# Altium schematic sheet connectors.SchDoc
size A
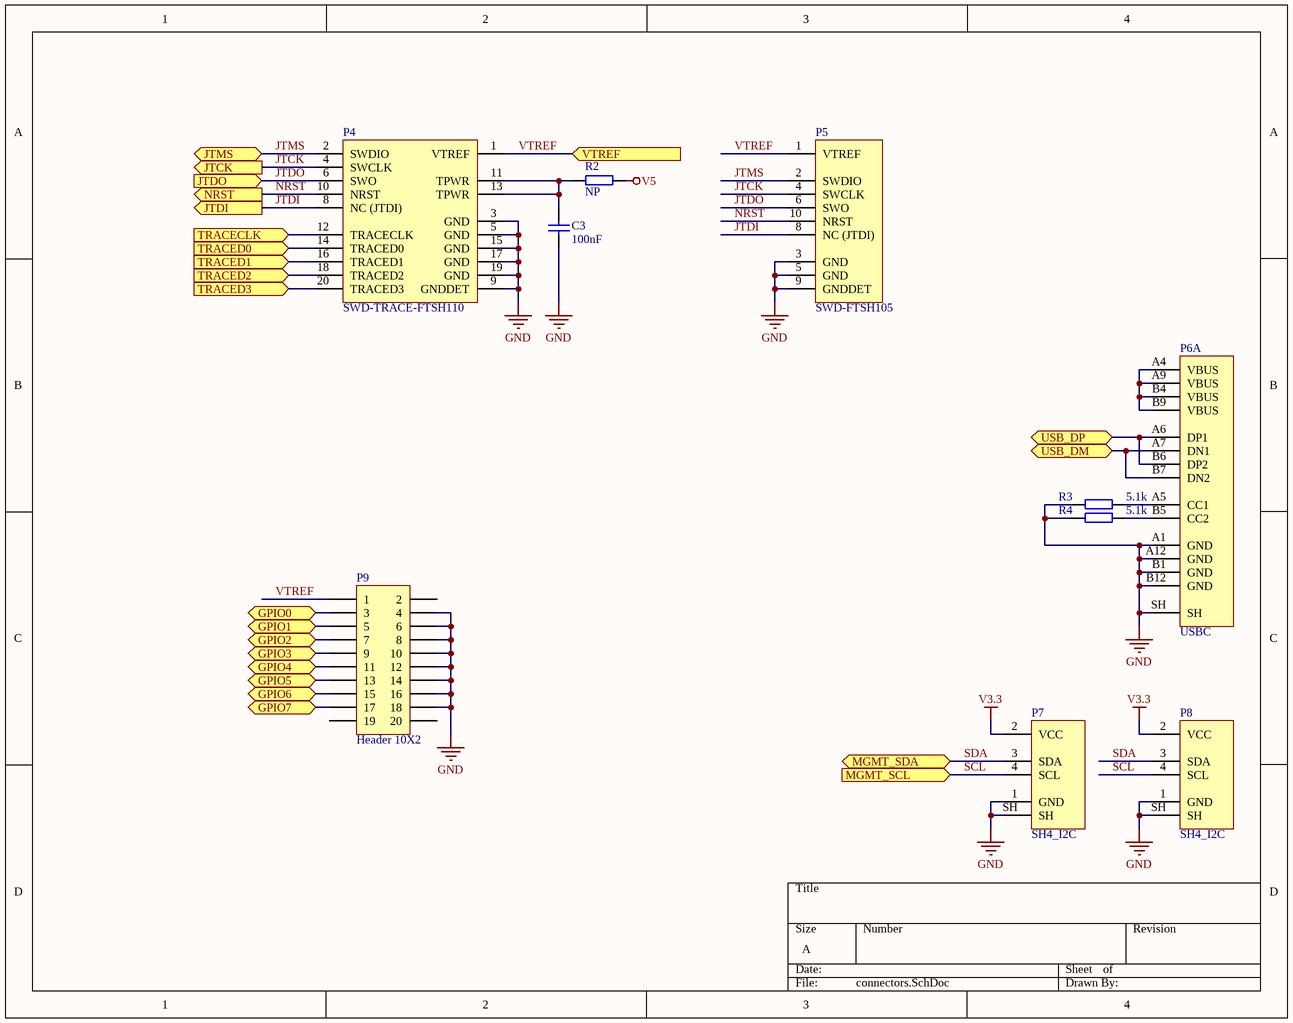
[diagram p0: connectors.SchDoc]

## Parts
C3  100nF  [0402]
P4  SWD-TRACE-FTSH110  [FTSH110]
P5  SWD-FTSH105  [FTSH105]
P6  USBC  [U262-161N-4BVC11]  (part A of 2)
P7  SH4_I2C  [SM04B]
P8  SH4_I2C  [SM04B]
P9  Header 10X2  [HDR2X10]
R2  NP  [0402]
R3  5.1k  [0402]
R4  5.1k  [0402]

## Ports
GPIO0 (bidir), GPIO1 (bidir), GPIO2 (bidir), GPIO3 (bidir), GPIO4 (bidir), GPIO5 (bidir), GPIO6 (bidir), GPIO7 (bidir), JTCK (out), JTDI (out), JTDO (in), JTMS (bidir), MGMT_SCL (in), MGMT_SDA (bidir), NRST (out), TRACECLK (in), TRACED0 (in), TRACED1 (in), TRACED2 (in), TRACED3 (in), USB_DM, USB_DP, VTREF (in)

## Nets
GND: C3.1 P4.3(GND) P4.5(GND) P4.9(GNDDET) P4.15(GND) P4.17(GND) P4.19(GND) P5.3(GND) P5.5(GND) P5.9(GNDDET) P6.A1(GND) P6.A12(GND) P6.B1(GND) P6.B12(GND) P6.SH P7.1(GND) P7.SH P8.1(GND) P8.SH P9.4 P9.6 P9.8 P9.10 P9.12 P9.14 P9.16 P9.18 R3.1 R4.1
V3.3: P7.2(VCC) P8.2(VCC)
V5: R2.2
GPIO0: P9.3 ; port GPIO0
GPIO1: P9.5 ; port GPIO1
GPIO2: P9.7 ; port GPIO2
GPIO3: P9.9 ; port GPIO3
GPIO4: P9.11 ; port GPIO4
GPIO5: P9.13 ; port GPIO5
GPIO6: P9.15 ; port GPIO6
GPIO7: P9.17 ; port GPIO7
JTCK: P4.4(SWCLK) P5.4(SWCLK) ; port JTCK
JTDI: P4.8(NC_(JTDI)) P5.8(NC_(JTDI)) ; port JTDI
JTDO: P4.6(SWO) P5.6(SWO) ; port JTDO
JTMS: P4.2(SWDIO) P5.2(SWDIO) ; port JTMS
NRST: P4.10(NRST) P5.10(NRST) ; port NRST
SCL: P7.4(SCL) P8.4(SCL) ; port MGMT_SCL
SDA: P7.3(SDA) P8.3(SDA) ; port MGMT_SDA
TRACECLK: P4.12(TRACECLK) ; port TRACECLK
TRACED0: P4.14(TRACED0) ; port TRACED0
TRACED1: P4.16(TRACED1) ; port TRACED1
TRACED2: P4.18(TRACED2) ; port TRACED2
TRACED3: P4.20(TRACED3) ; port TRACED3
USB_DM: P6.A7(DN1) P6.B7(DN2) ; port USB_DM
USB_DP: P6.A6(DP1) P6.B6(DP2) ; port USB_DP
VTREF: P4.1(VTREF) P5.1(VTREF) P9.1 ; port VTREF
NetC3_2: C3.2 P4.11(TPWR) P4.13(TPWR) R2.1
NetP6_A4: P6.A4(VBUS) P6.A9(VBUS) P6.B4(VBUS) P6.B9(VBUS)
NetP6_A5: P6.A5(CC1) R3.2
NetP6_B5: P6.B5(CC2) R4.2

Not connected (* = marked no-connect by the designer): P9 2 19 20

## Library data of the parts
C3 = Capacitor: Value: 100nF
P6 = USBC: pin to pad: A2>none A3>none A10>none A11>none B2>none B3>none B10>none B11>none
P7 P8 = SH4_I2C: Qwiic / STEMMA QT Compatible
P9 = Header 10X2: Header, 10-Pin, Dual row; LatestRevisionDate: 17-Jul-2002; LatestRevisionNote: Re-released for DXP Platform.; Publisher: Altium Limited
R2-R4 = Resistor
  R2: Value: NP
  R3 R4: Value: 5.1k